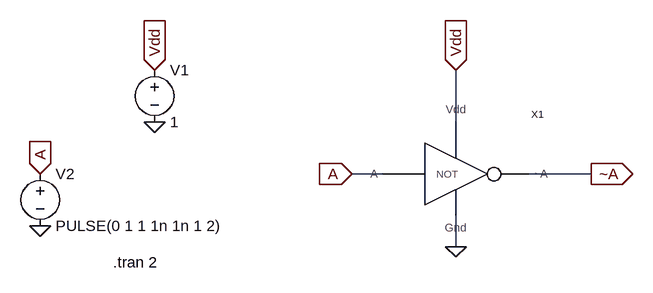
[diagram p0: schematic NOT_Test.asc]
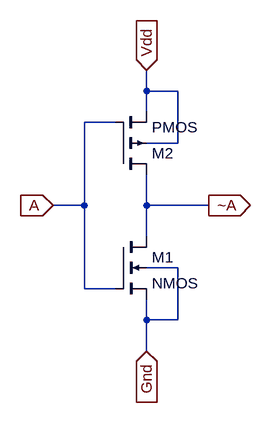
[diagram p1: sub-circuit not.asc]
NOT_Test.asc, the LTspice schematic file:
Version 4
SHEET 1 880 680
WIRE 368 128 368 48
WIRE 256 208 208 208
WIRE 576 208 480 208
WIRE 368 320 368 272
FLAG -96 48 Vdd
IOPIN -96 48 In
FLAG -272 208 A
IOPIN -272 208 In
FLAG -96 128 0
FLAG -272 288 0
FLAG 368 320 0
FLAG 208 208 A
IOPIN 208 208 In
FLAG 576 208 ~A
IOPIN 576 208 Out
FLAG 368 48 Vdd
IOPIN 368 48 In
SYMBOL NOT 368 192 R0
SYMATTR InstName X1
SYMBOL voltage -96 32 R0
SYMATTR InstName V1
SYMATTR Value 1
SYMBOL voltage -272 192 R0
WINDOW 123 0 0 Left 0
WINDOW 39 0 0 Left 0
SYMATTR InstName V2
SYMATTR Value PULSE(0 1 1 1n 1n 1 2)
TEXT -160 344 Left 2 !.tran 2

not.asc, the sub-circuit schematic file:
Version 4
SHEET 1 880 680
WIRE 304 -112 304 -144
WIRE 352 -112 304 -112
WIRE 304 -80 304 -112
WIRE 256 -64 208 -64
WIRE 352 -32 352 -112
WIRE 352 -32 304 -32
WIRE 208 64 208 -64
WIRE 208 64 160 64
WIRE 304 64 304 16
WIRE 400 64 304 64
WIRE 304 112 304 64
WIRE 352 160 304 160
WIRE 208 192 208 64
WIRE 256 192 208 192
WIRE 304 240 304 208
WIRE 352 240 352 160
WIRE 352 240 304 240
WIRE 304 288 304 240
FLAG 304 -144 Vdd
IOPIN 304 -144 In
FLAG 160 64 A
IOPIN 160 64 In
FLAG 400 64 ~A
IOPIN 400 64 Out
FLAG 304 288 Gnd
IOPIN 304 288 In
SYMBOL nmos4 256 112 R0
SYMATTR InstName M1
SYMBOL pmos4 256 16 M180
SYMATTR InstName M2

The netlist it stands for:
* NOT_Test.asc
XX1 A ~A Vdd 0 not
V1 Vdd 0 1
V2 A 0 PULSE(0 1 1 1n 1n 1 2)

* block symbol definitions
.subckt not A ~A Vdd Gnd
M1 ~A A Gnd Gnd NMOS
M2 ~A A Vdd Vdd PMOS
.ends not

.model NMOS NMOS
.model PMOS PMOS
.lib standard.mos
.tran 2
.backanno
.end

* Results of the author's LTspice run, read from the files saved beside the schematic
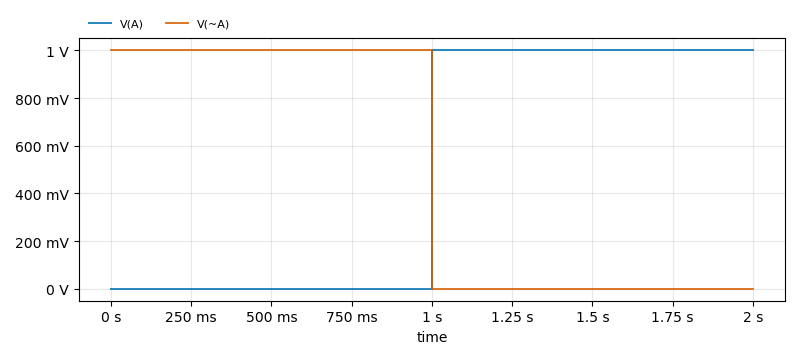
[diagram p2: Transient Analysis of NOT_Test.asc, plotted from the saved traces]
* Transient Analysis, 1 run:
*   V(A): min 0 V, max 1 V, average 500 mV, rms 707.1 mV, last 1 V
*   V(~A): min 0 V, max 1 V, average 500 mV, rms 707.1 mV, last 100.5 nV